# EAGLE design Hori_Dpad (EAGLE 9.1.3)
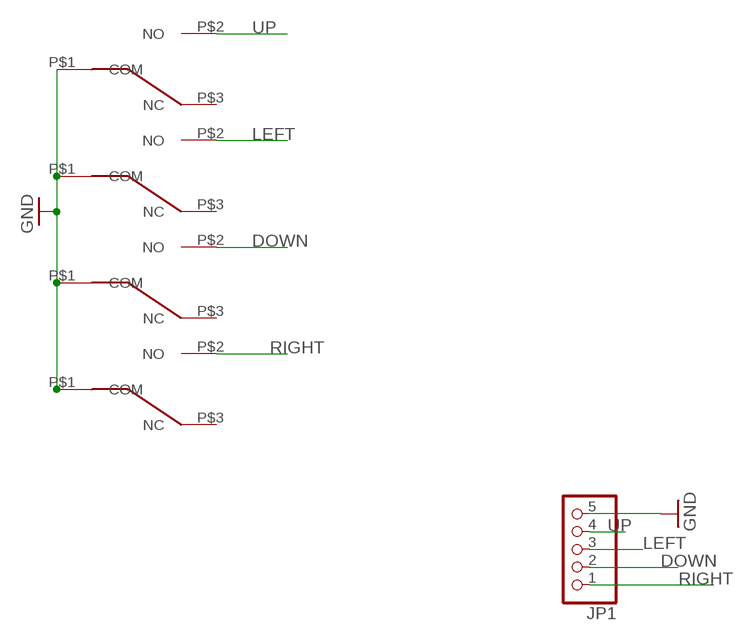
[diagram p0: schematic, sheet 1]

## Parts
DOWN  OMRON_D2FC-F-7N  [D2FC-F-K]
JP1  PINHD-1X05_2.00  [1X05M]
LEFT  OMRON_D2FC-F-7N  [D2FC-F-K]
RIGHT  OMRON_D2FC-F-7N  [D2FC-F-K]
UP  OMRON_D2FC-F-7N  [D2FC-F-K]

## Nets
DOWN: DOWN.P$2(NO) JP1.2
GND: DOWN.P$1(COM) JP1.5 LEFT.P$1(COM) RIGHT.P$1(COM) UP.P$1(COM)
LEFT: JP1.3 LEFT.P$2(NO)
RIGHT: JP1.1 RIGHT.P$2(NO)
UP: JP1.4 UP.P$2(NO)
Unconnected: DOWN.P$3(NC) LEFT.P$3(NC) RIGHT.P$3(NC) UP.P$3(NC)

## Library data of the parts
DOWN LEFT RIGHT UP = TRP_Custom:OMRON_D2FC-F-7N
JP1 = pinhead-2:PINHD-1X05: PIN HEADER

## Board
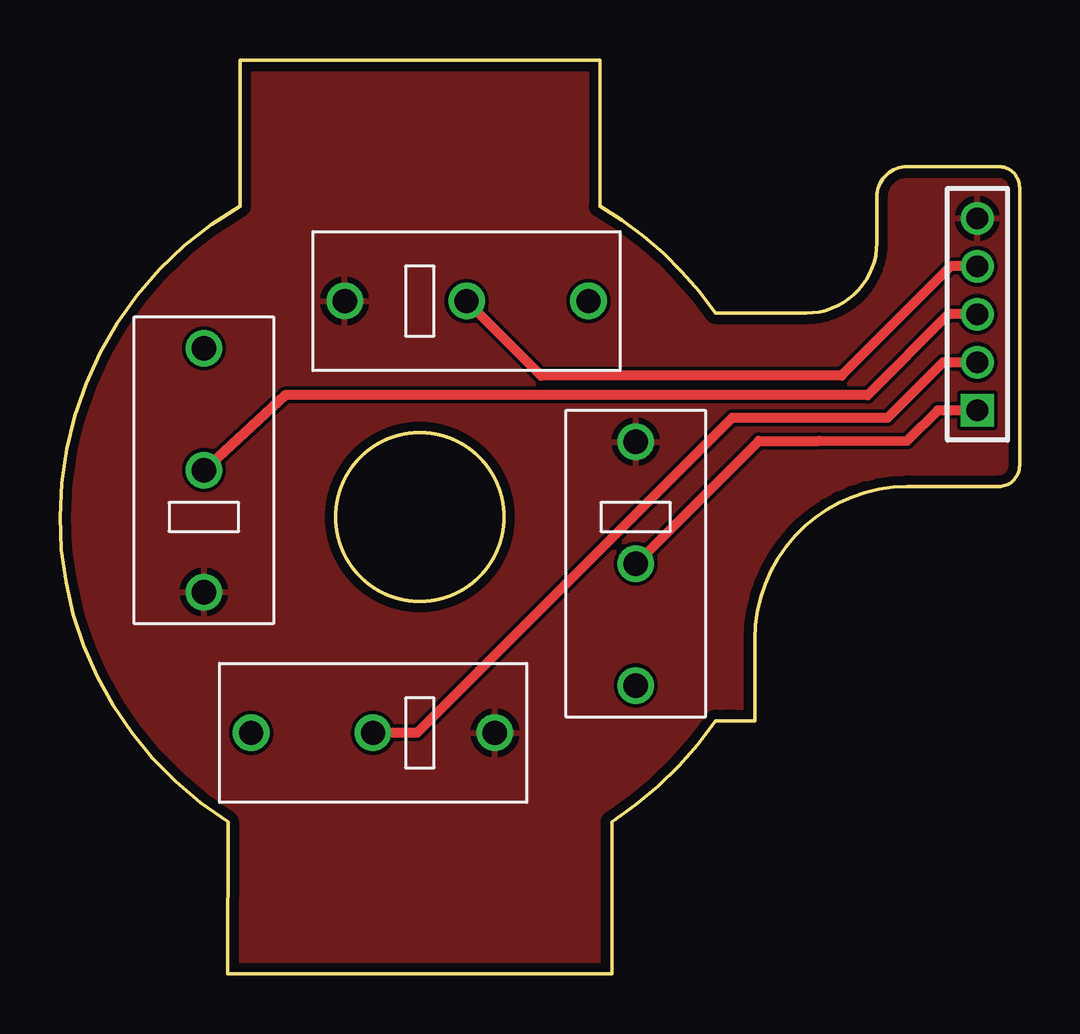
[diagram p1: board, top side]
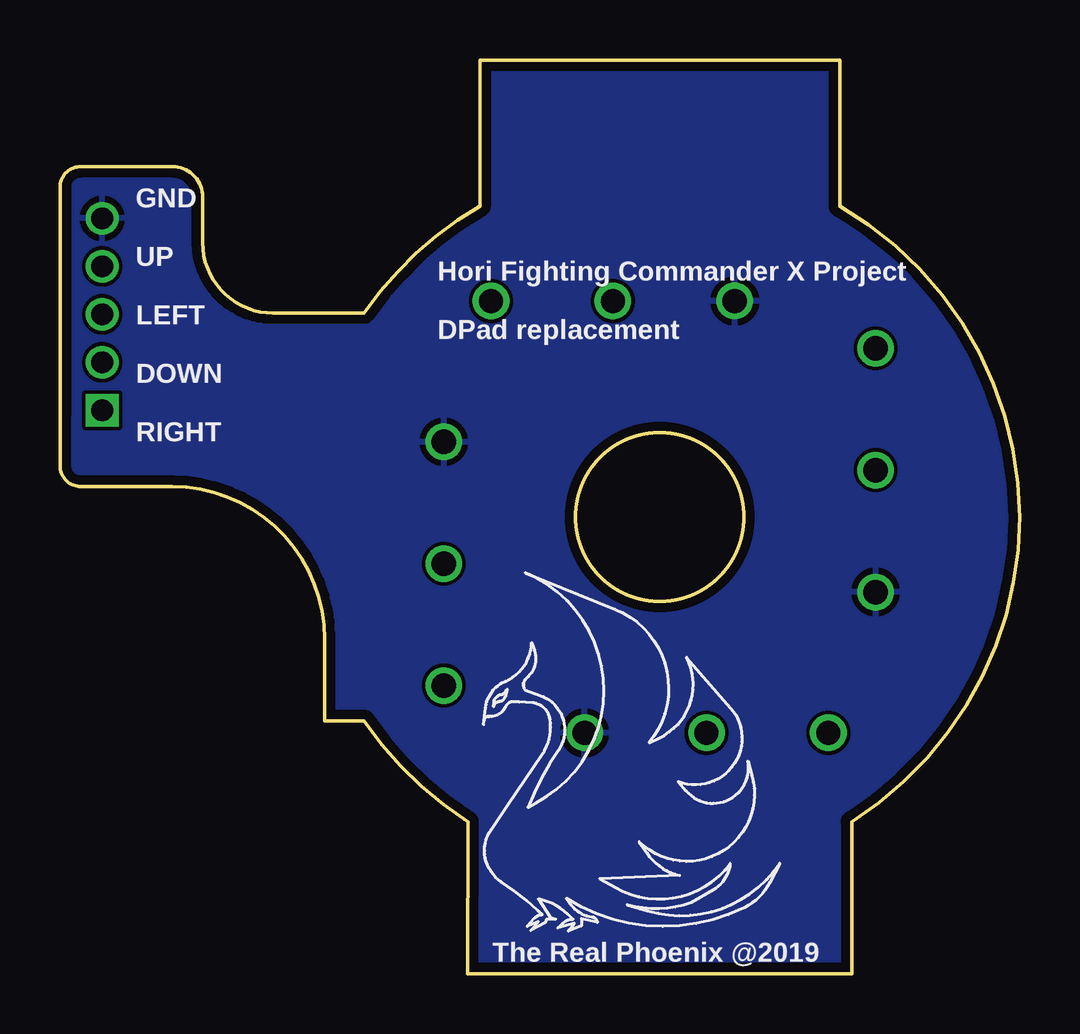
[diagram p2: board, bottom side, seen from below]

Size 40 x 38.1 mm. Coordinates in mm from the lower left corner, seen from the top.
Outline: 27.32,27.55 31.12,27.55 arc90 34.05,30.48 34.05,32.39 arc-90 35.32,33.66 39.13,33.66 arc-90 40,32.78 40,27.55 40,23.25 40,21.19 arc-90 39.13,20.32 35.32,20.32 arc90 28.97,13.97 28.97,12.83 28.97,10.54 28.58,10.55 28.09,10.55 27.7,10.55 27.32,10.55 arc-23 23,6.35 23,0 7,0 7,6.35 arc-58 0,19.05 arc-60 7.5,32 7.5,38.1 22.5,38.1 22.5,32 arc-25 27.32,27.55
Outline: circle at 15,19.05 radius 3.5
Copper layers (1*16): Top 0.035559375mm / dielectric 1.6mm / Bottom 0.035559375mm
Design rules "oshpark-2layer": minimum track width 6mil, minimum drill 10mil, track to track 6mil, track to pad 6mil, pad to pad 6mil, via to via 6mil, smd to smd 6mil, copper to edge 15mil, drill to drill 6mil, minimum pad ring 5mil, minimum via ring 5mil, stop-mask expansion 2.5mil, vias tented up to drill 0mil, thermal gap 10mil

### Footprints (pad centres in the part's own frame; a part is rotated, then mirrored left to right if it is on the bottom)
D2FC-F-K = drill 1.016: P$1 -3.13,0; P$2 1.95,0; P$3 7.03,0
1X05M = drill 0.914 square: 1 -4,0 | drill 0.914: 2 -2,0; 3 0,0; 4 2,0; 5 4,0

### Placement (x,y rotation side)
DOWN  15,10.05 180 top
JP1  38.24,27.5 90 top
LEFT  6,19.05 90 top
RIGHT  24,19.05 270 top
U$1  [LOGO]  25.8,0.25 0 bottom
UP  15,28.05 0 top

### Tracks (layer width: path | path; a pad name or v marks a point on that pad's centre or on a via)
DOWN
  Top 0.406: DOWN.P$2 14.89,10.05 23.89,19.05 28.03,23.19 34.51,23.19 36.81,25.5 JP1.2
GND
  pour Bottom: -1.51,39.37 40.4,39.37 40.4,-1.27 -1.51,-1.27
  pour Top: -1.51,39.37 40.4,39.37 40.4,-1.27 -1.51,-1.27
LEFT
  Top 0.406: LEFT.P$2 9.38,24.13 33.67,24.13 37.03,27.5 JP1.3
RIGHT
  Top 0.406: JP1.1 36.59,23.5 35.32,22.23 31.64,22.23 29.12,22.23 RIGHT.P$2
UP
  Top 0.406: UP.P$2 20.06,24.94 32.58,24.94 36.72,29.08 37.13,29.5 JP1.4

### Text on the board
bNames: GND / / UP / / LEFT / / DOWN / / RIGHT | Hori Fighting Commander X Project / / DPad replacement | The Real Phoenix @2019